# EAGLE schematic Ex 8 LED.PCB.SMD.OPM-AMP (EAGLE 7.2.0)
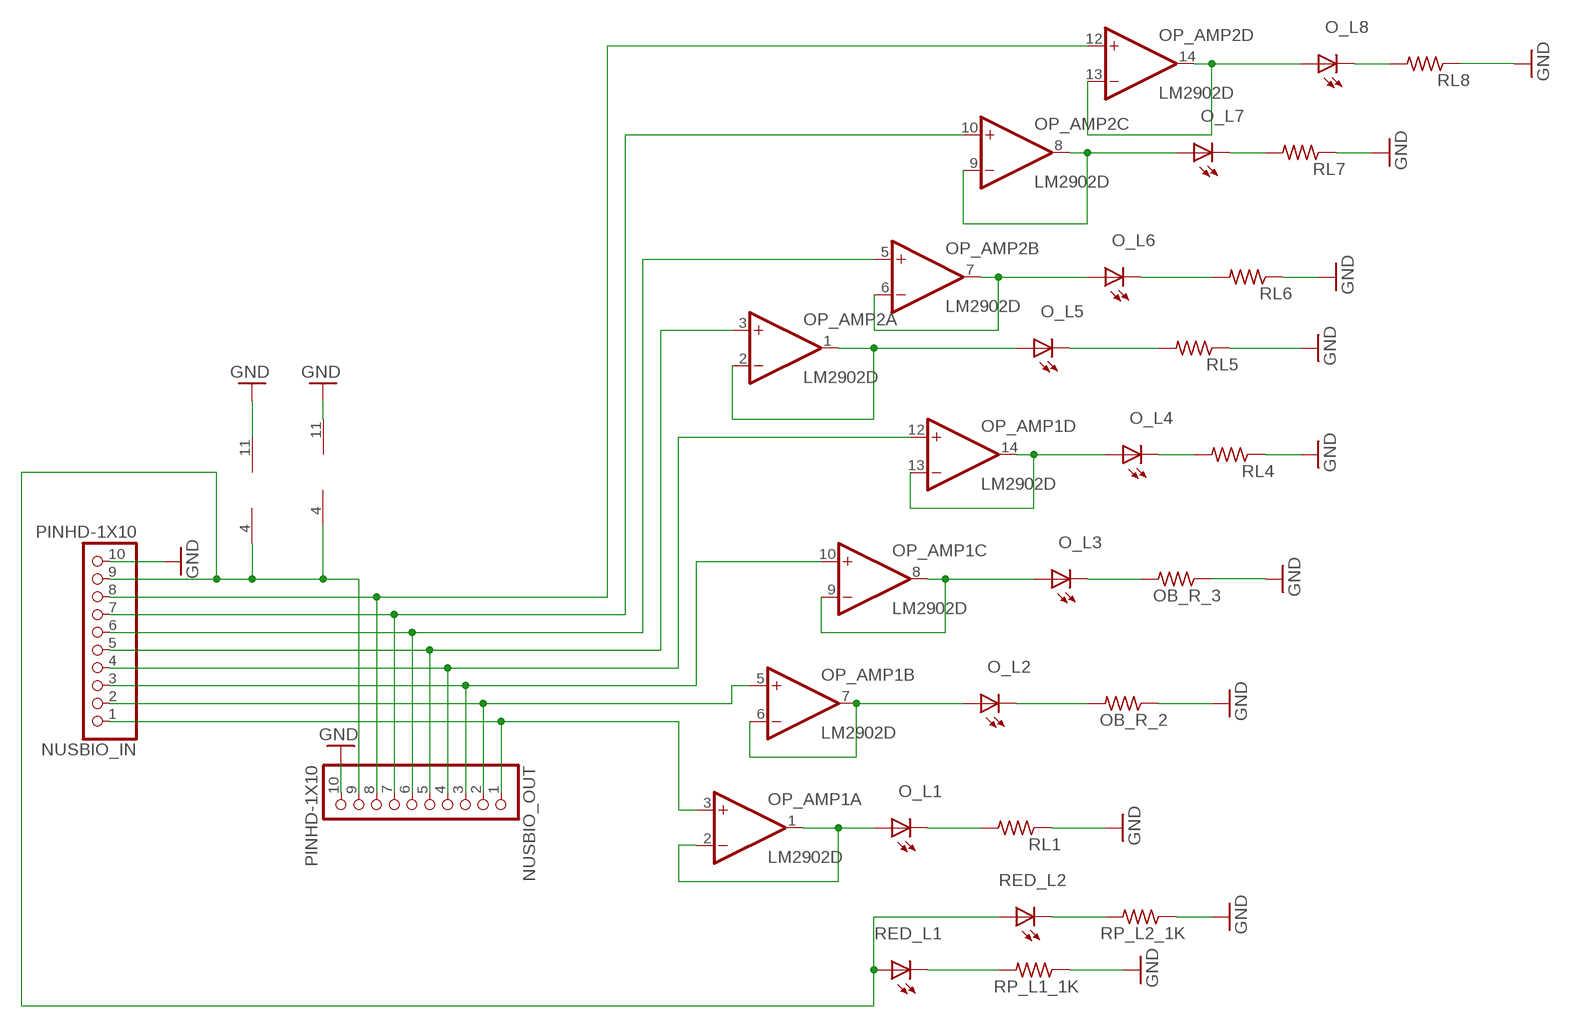
[diagram p0: schematic, sheet 1]

## Parts
NUSBIO_IN  PINHD-1X10  [1X10-BIG]
NUSBIO_OUT  PINHD-1X10  [1X10-BIG]
O_L1  LEDCHIPLED_0805  [CHIPLED_0805]
O_L2  LEDCHIPLED_0805  [CHIPLED_0805]
O_L3  LEDCHIPLED_0805  [CHIPLED_0805]
O_L4  LEDCHIPLED_0805  [CHIPLED_0805]
O_L5  LEDCHIPLED_0805  [CHIPLED_0805]
O_L6  LEDCHIPLED_0805  [CHIPLED_0805]
O_L7  LEDCHIPLED_0805  [CHIPLED_0805]
O_L8  LEDCHIPLED_0805  [CHIPLED_0805]
OB_R_2  R-US_R0805  [R0805]
OB_R_3  R-US_R0805  [R0805]
OP_AMP1  LM2902D  [SO14]
OP_AMP2  LM2902D  [SO14]
RED_L1  LEDCHIPLED_0805  [CHIPLED_0805]
RED_L2  LEDCHIPLED_0805  [CHIPLED_0805]
RL1  R-US_R0805  [R0805]
RL4  R-US_R0805  [R0805]
RL5  R-US_R0805  [R0805]
RL6  R-US_R0805  [R0805]
RL7  R-US_R0805  [R0805]
RL8  R-US_R0805  [R0805]
RP_L1_1K  R-US_R0805  [R0805]
RP_L2_1K  R-US_R0805  [R0805]

## Nets
GND: NUSBIO_IN.10 NUSBIO_OUT.10 OB_R_2.1 OB_R_3.1 OP_AMP1.11(P:V-) OP_AMP2.11(P:V-) RL1.1 RL4.1 RL5.1 RL6.1 RL7.1 RL8.1 RP_L1_1K.1 RP_L2_1K.1
N$1: O_L1.A OP_AMP1.1(A:OUT) OP_AMP1.2(A:-IN)
N$2: O_L1.C RL1.2
N$3: NUSBIO_IN.1 NUSBIO_OUT.1 OP_AMP1.3(A:+IN)
N$4: NUSBIO_IN.2 NUSBIO_OUT.2 OP_AMP1.5(B:+IN)
N$5: NUSBIO_IN.3 NUSBIO_OUT.3 OP_AMP1.10(C:+IN)
N$6: NUSBIO_IN.4 NUSBIO_OUT.4 OP_AMP1.12(D:+IN)
N$7: NUSBIO_IN.5 NUSBIO_OUT.5 OP_AMP2.3(A:+IN)
N$8: NUSBIO_IN.6 NUSBIO_OUT.6 OP_AMP2.5(B:+IN)
N$9: NUSBIO_IN.7 NUSBIO_OUT.7 OP_AMP2.10(C:+IN)
N$10: NUSBIO_IN.8 NUSBIO_OUT.8 OP_AMP2.12(D:+IN)
N$11: NUSBIO_IN.9 NUSBIO_OUT.9 OP_AMP1.4(P:V+) OP_AMP2.4(P:V+) RED_L1.A RED_L2.A
N$12: O_L2.A OP_AMP1.6(B:-IN) OP_AMP1.7(B:OUT)
N$14: O_L3.A OP_AMP1.8(C:OUT) OP_AMP1.9(C:-IN)
N$15: O_L3.C OB_R_3.2
N$16: O_L4.A OP_AMP1.13(D:-IN) OP_AMP1.14(D:OUT)
N$18: O_L5.A OP_AMP2.1(A:OUT) OP_AMP2.2(A:-IN)
N$19: O_L5.C RL5.2
N$20: O_L6.A OP_AMP2.6(B:-IN) OP_AMP2.7(B:OUT)
N$21: O_L6.C RL6.2
N$22: O_L7.A OP_AMP2.8(C:OUT) OP_AMP2.9(C:-IN)
N$23: O_L7.C RL7.2
N$24: O_L8.A OP_AMP2.13(D:-IN) OP_AMP2.14(D:OUT)
N$25: O_L8.C RL8.2
N$26: RED_L1.C RP_L1_1K.2
N$27: RED_L2.C RP_L2_1K.2
O_L2: O_L2.C OB_R_2.2
O_L4: O_L4.C RL4.2

## Library data of the parts
NUSBIO_IN NUSBIO_OUT = adafruit:PINHD-1X10: Pin header 1x10 0.1" spacing With round pins
O_L1-O_L8 RED_L1 RED_L2 = adafruit:LED: LED OSRAM: - CHIPLED LG R971, LG N971, LY N971, LG Q971, LY Q971, LO R971, LY R971 LH N974, LH R974 LS Q976, LO Q976, LY Q976 LO Q996 - Hyper CHIPLED LW Q18S LB Q993, LB Q99A, LB R99A - SideLED LS A670, LO A670, LY A670, LG A670, LP A670 LB A673, LV A673, LT A673, LW A673 LH A674 LY A675 LS A676, LA A676, LO A676, LY A676, LW A676 LS A679, LY A679, LG A679 - Hyper Micro SIDELED® LS Y876, LA Y876, LO Y876, LY Y876 LT Y87S - SmartLED LW L88C, LW L88S LB L89C, LB L89S, LG L890 LS L89K, LO L89K, LY L89K LS L896, LA L896, LO L896, LY L896 - TOPLED LS T670, LO T670, LY T670, LG T670, LP T670 LSG T670, LSP T670, LSY T670, LOP T670, LYG T670 LG T671, LOG T671, LSG T671 LB T673, LV T673, LT T673, LW T673 LH T674 LS T676, LA T676, LO T676, LY T676, LB T676, LH T676, LSB T676, LW T676 LB T67C, LV T67C, LT T67C, LS T67K, LO T67K, LY T67K, LW E67C LS E67B, LA E67B, LO E67B, LY E67B, LB E67C, LV E67C, LT E67C LW T67C LS T679, LY T679, LG T679 LS T770, LO T770, LY T770, LG T770, LP T770 LB T773, LV T773, LT T773, LW T773 LH T774 LS E675, LA E675, LY E675, LS T675 LS T776, LA T776, LO T776, LY T776, LB T776 LHGB T686 LT T68C, LB T68C - Hyper Mini TOPLED® LB M676 - Mini TOPLED Santana® LG M470 LS M47K, LO M47K, LY M47K Source: http://www.osram.convergy.de/
OB_R_2 OB_R_3 RL1 RL4-RL8 RP_L1_1K RP_L2_1K = adafruit:R-US_: RESISTOR, American symbol
OP_AMP1 OP_AMP2 = linear:LM2902: Low power quad operational amplifier Source: Data sgeet <http://www.st.com/internet/com/TECHNICAL_RESOURCES/TECHNICAL_LITERATURE/DATASHEET/CD00000533.pdf>